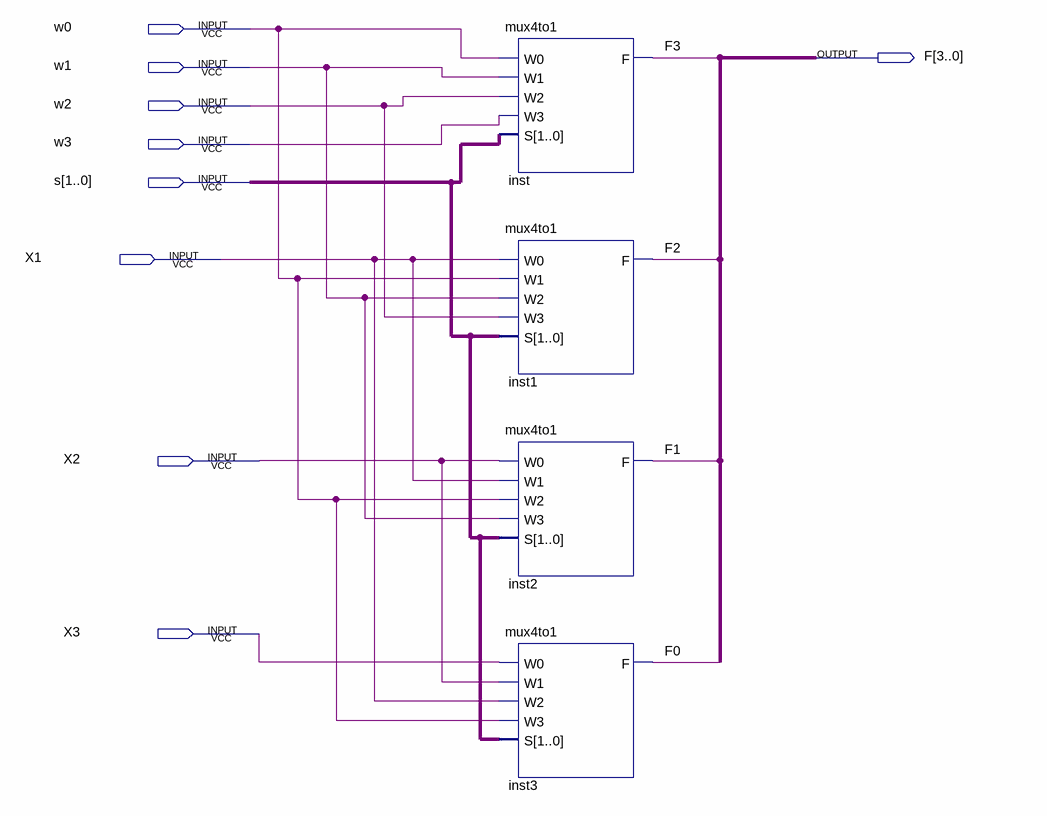
[diagram p0: schematic sheet]
// Quartus schematic lab8step2.bdf as structural Verilog: 4 symbols, 9 pins
module lab8step2 (
  input  w0,
  input  w1,
  input  w2,
  input  w3,
  input  [1:0] s,
  input  X1,
  input  X2,
  input  X3,
  output [3:0] F
);

  mux4to1 inst (.W0(w0), .W1(w1), .W2(w2), .W3(w3), .S(s), .F(F[3]));
  mux4to1 inst1 (.W0(X1), .W1(w0), .W2(w1), .W3(w2), .S(s), .F(F[2]));
  mux4to1 inst2 (.W0(X2), .W1(X1), .W2(w0), .W3(w1), .S(s), .F(F[1]));
  mux4to1 inst3 (.W0(X3), .W1(X2), .W2(X1), .W3(w0), .S(s), .F(F[0]));
endmodule
